# Altium schematic sheet Control sheet1.SchDoc
size A4; SheetNumber: 1; SheetTotal: 2
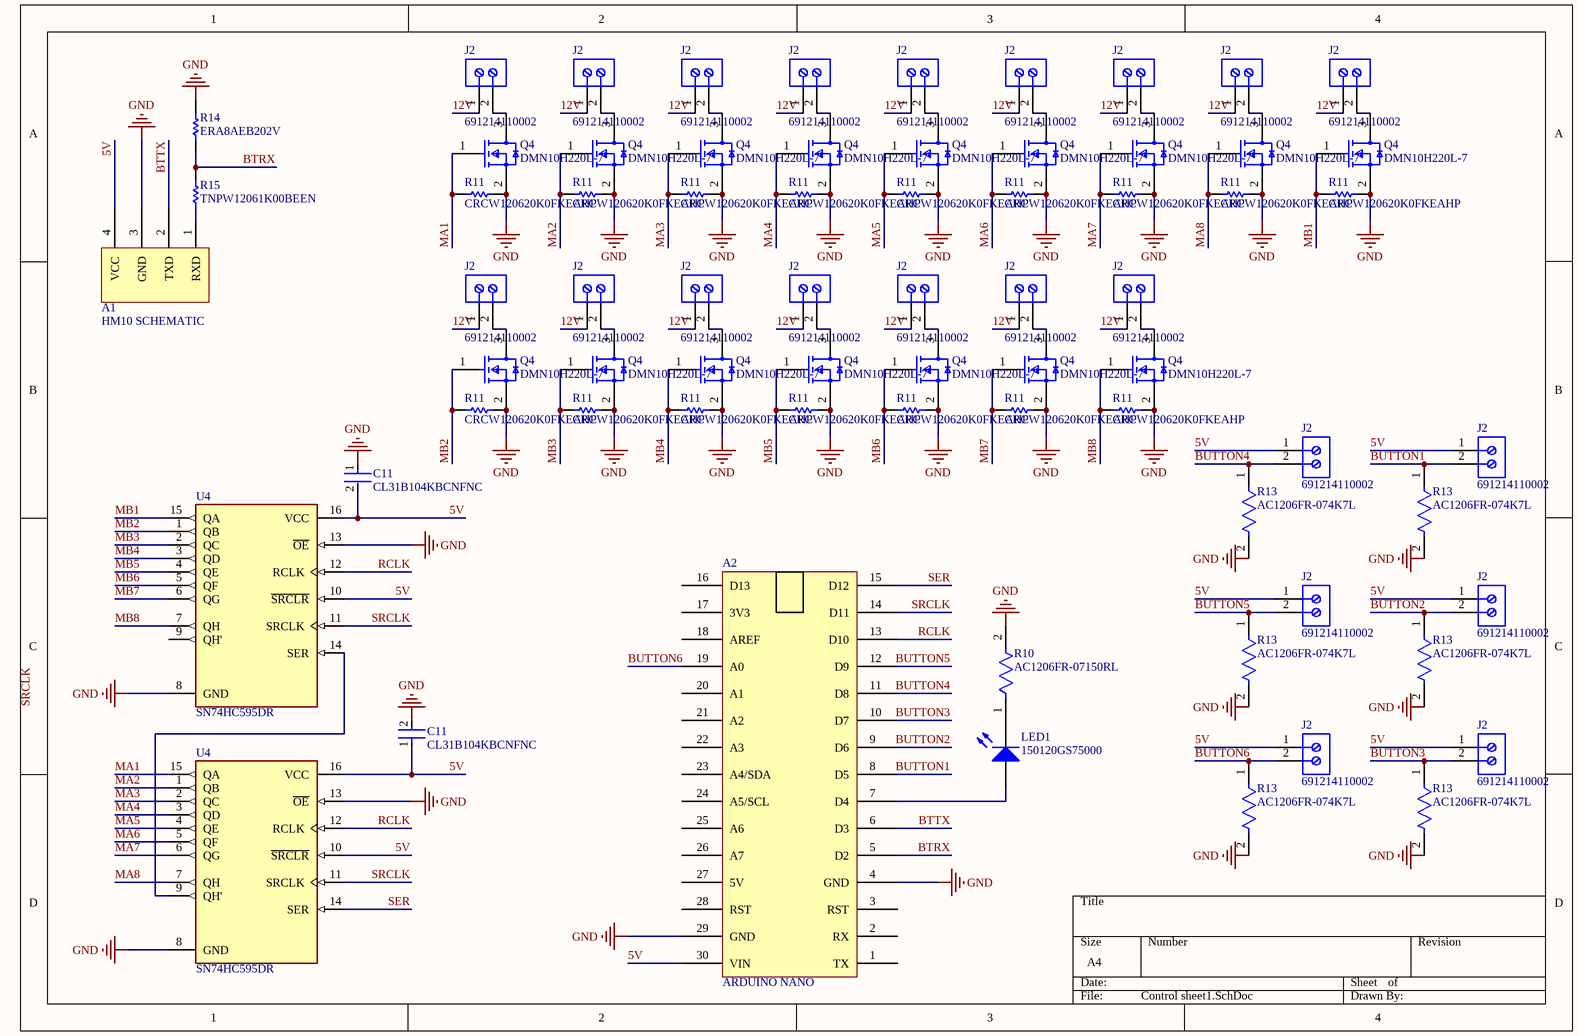
[diagram p0: Control sheet1.SchDoc]

## Parts
(Parts that share a designator on the sheet are numbered #1, #2 ... from top to bottom, then left to right.)
A1  HM10 SCHEMATIC  [HM10]
A2  ARDUINO NANO  [ARDUINO NANO]
C11#1  CL31B104KBCNFNC  [FP-CL31-IPC_C]
C11#2  CL31B104KBCNFNC  [FP-CL31-IPC_C]
J2#1  691214110002  [691214110002]
J2#2  691214110002  [691214110002]
J2#3  691214110002  [691214110002]
J2#4  691214110002  [691214110002]
J2#5  691214110002  [691214110002]
J2#6  691214110002  [691214110002]
J2#7  691214110002  [691214110002]
J2#8  691214110002  [691214110002]
J2#9  691214110002  [691214110002]
J2#10  691214110002  [691214110002]
J2#11  691214110002  [691214110002]
J2#12  691214110002  [691214110002]
J2#13  691214110002  [691214110002]
J2#14  691214110002  [691214110002]
J2#15  691214110002  [691214110002]
J2#16  691214110002  [691214110002]
J2#17  691214110002  [691214110002]
J2#18  691214110002  [691214110002]
J2#19  691214110002  [691214110002]
J2#20  691214110002  [691214110002]
J2#21  691214110002  [691214110002]
J2#22  691214110002  [691214110002]
LED1  150120GS75000  [1206_A]
Q4#1  DMN10H220L-7  [FP-SOT23-MFG]
Q4#2  DMN10H220L-7  [FP-SOT23-MFG]
Q4#3  DMN10H220L-7  [FP-SOT23-MFG]
Q4#4  DMN10H220L-7  [FP-SOT23-MFG]
Q4#5  DMN10H220L-7  [FP-SOT23-MFG]
Q4#6  DMN10H220L-7  [FP-SOT23-MFG]
Q4#7  DMN10H220L-7  [FP-SOT23-MFG]
Q4#8  DMN10H220L-7  [FP-SOT23-MFG]
Q4#9  DMN10H220L-7  [FP-SOT23-MFG]
Q4#10  DMN10H220L-7  [FP-SOT23-MFG]
Q4#11  DMN10H220L-7  [FP-SOT23-MFG]
Q4#12  DMN10H220L-7  [FP-SOT23-MFG]
Q4#13  DMN10H220L-7  [FP-SOT23-MFG]
Q4#14  DMN10H220L-7  [FP-SOT23-MFG]
Q4#15  DMN10H220L-7  [FP-SOT23-MFG]
Q4#16  DMN10H220L-7  [FP-SOT23-MFG]
R10  AC1206FR-07150RL  [FP-AC1206-MFG]
R11#1  CRCW120620K0FKEAHP  [RESC3116X65X50LL20T20]
R11#2  CRCW120620K0FKEAHP  [RESC3116X65X50LL20T20]
R11#3  CRCW120620K0FKEAHP  [RESC3116X65X50LL20T20]
R11#4  CRCW120620K0FKEAHP  [RESC3116X65X50LL20T20]
R11#5  CRCW120620K0FKEAHP  [RESC3116X65X50LL20T20]
R11#6  CRCW120620K0FKEAHP  [RESC3116X65X50LL20T20]
R11#7  CRCW120620K0FKEAHP  [RESC3116X65X50LL20T20]
R11#8  CRCW120620K0FKEAHP  [RESC3116X65X50LL20T20]
R11#9  CRCW120620K0FKEAHP  [RESC3116X65X50LL20T20]
R11#10  CRCW120620K0FKEAHP  [RESC3116X65X50LL20T20]
R11#11  CRCW120620K0FKEAHP  [RESC3116X65X50LL20T20]
R11#12  CRCW120620K0FKEAHP  [RESC3116X65X50LL20T20]
R11#13  CRCW120620K0FKEAHP  [RESC3116X65X50LL20T20]
R11#14  CRCW120620K0FKEAHP  [RESC3116X65X50LL20T20]
R11#15  CRCW120620K0FKEAHP  [RESC3116X65X50LL20T20]
R11#16  CRCW120620K0FKEAHP  [RESC3116X65X50LL20T20]
R13#1  AC1206FR-074K7L  [FP-AC1206-MFG]
R13#2  AC1206FR-074K7L  [FP-AC1206-MFG]
R13#3  AC1206FR-074K7L  [FP-AC1206-MFG]
R13#4  AC1206FR-074K7L  [FP-AC1206-MFG]
R13#5  AC1206FR-074K7L  [FP-AC1206-MFG]
R13#6  AC1206FR-074K7L  [FP-AC1206-MFG]
R14  ERA8AEB202V  [RESC3216X70X50ML20T25]
R15  TNPW12061K00BEEN  [RESC3216X65X50ML15T25]
U4#1  SN74HC595DR  [FP-D0016A-MFG]
U4#2  SN74HC595DR  [FP-D0016A-MFG]

## Nets
GND: A1.3(GND) A2.4(GND) A2.29(GND) C11#1.1 C11#2.2 Q4#1.2(S) Q4#2.2(S) Q4#3.2(S) Q4#4.2(S) Q4#5.2(S) Q4#6.2(S) Q4#7.2(S) Q4#8.2(S) Q4#9.2(S) Q4#10.2(S) Q4#11.2(S) Q4#12.2(S) Q4#13.2(S) Q4#14.2(S) Q4#15.2(S) Q4#16.2(S) R10.2 R11#1.2 R11#2.2 R11#3.2 R11#4.2 R11#5.2 R11#6.2 R11#7.2 R11#8.2 R11#9.2 R11#10.2 R11#11.2 R11#12.2 R11#13.2 R11#14.2 R11#15.2 R11#16.2 R13#1.2 R13#2.2 R13#3.2 R13#4.2 R13#5.2 R13#6.2 R14.2 U4#1.8(GND) U4#1.13(~{OE}) U4#2.8(GND) U4#2.13(~{OE})
5V: A1.4(VCC) A2.30(VIN) C11#1.2 C11#2.1 J2#17.1 J2#18.1 J2#19.1 J2#20.1 J2#21.1 J2#22.1 U4#1.10(~{SRCLR}) U4#1.16(VCC) U4#2.10(~{SRCLR}) U4#2.16(VCC)
12V: J2#1.1 J2#2.1 J2#3.1 J2#4.1 J2#5.1 J2#6.1 J2#7.1 J2#8.1 J2#9.1 J2#10.1 J2#11.1 J2#12.1 J2#13.1 J2#14.1 J2#15.1 J2#16.1
BTRX: A2.5(D2) R14.1 R15.2
BTTX: A1.2(TXD) A2.6(D3)
BUTTON1: A2.8(D5) J2#18.2 R13#2.1
BUTTON2: A2.9(D6) J2#20.2 R13#4.1
BUTTON3: A2.10(D7) J2#22.2 R13#6.1
BUTTON4: A2.11(D8) J2#17.2 R13#1.1
BUTTON5: A2.12(D9) J2#19.2 R13#3.1
BUTTON6: A2.19(A0) J2#21.2 R13#5.1
MA1: Q4#1.1(G) R11#1.1 U4#2.15(QA)
MA2: Q4#2.1(G) R11#2.1 U4#2.1(QB)
MA3: Q4#3.1(G) R11#3.1 U4#2.2(QC)
MA4: Q4#4.1(G) R11#4.1 U4#2.3(QD)
MA5: Q4#5.1(G) R11#5.1 U4#2.4(QE)
MA6: Q4#6.1(G) R11#6.1 U4#2.5(QF)
MA7: Q4#7.1(G) R11#7.1 U4#2.6(QG)
MA8: Q4#8.1(G) R11#8.1 U4#2.7(QH)
MB1: Q4#9.1(G) R11#9.1 U4#1.15(QA)
MB2: Q4#10.1(G) R11#10.1 U4#1.1(QB)
MB3: Q4#11.1(G) R11#11.1 U4#1.2(QC)
MB4: Q4#12.1(G) R11#12.1 U4#1.3(QD)
MB5: Q4#13.1(G) R11#13.1 U4#1.4(QE)
MB6: Q4#14.1(G) R11#14.1 U4#1.5(QF)
MB7: Q4#15.1(G) R11#15.1 U4#1.6(QG)
MB8: Q4#16.1(G) R11#16.1 U4#1.7(QH)
RCLK: A2.13(D10) U4#1.12(RCLK) U4#2.12(RCLK)
SER: A2.15(D12) U4#2.14(SER)
SRCLK: A2.14(D11) U4#1.11(SRCLK) U4#2.11(SRCLK)
NetA1_1: A1.1(RXD) R15.1
NetA2_7: A2.7(D4) LED1.2(A)
NetJ2#1_2: J2#1.2 Q4#1.3(D)
NetJ2#2_2: J2#2.2 Q4#2.3(D)
NetJ2#3_2: J2#3.2 Q4#3.3(D)
NetJ2#4_2: J2#4.2 Q4#4.3(D)
NetJ2#5_2: J2#5.2 Q4#5.3(D)
NetJ2#6_2: J2#6.2 Q4#6.3(D)
NetJ2#7_2: J2#7.2 Q4#7.3(D)
NetJ2#8_2: J2#8.2 Q4#8.3(D)
NetJ2#9_2: J2#9.2 Q4#9.3(D)
NetJ2#10_2: J2#10.2 Q4#10.3(D)
NetJ2#11_2: J2#11.2 Q4#11.3(D)
NetJ2#12_2: J2#12.2 Q4#12.3(D)
NetJ2#13_2: J2#13.2 Q4#13.3(D)
NetJ2#14_2: J2#14.2 Q4#14.3(D)
NetJ2#15_2: J2#15.2 Q4#15.3(D)
NetJ2#16_2: J2#16.2 Q4#16.3(D)
NetLED1_1: LED1.1(K) R10.1
NetU4#1_14: U4#1.14(SER) U4#2.9(QH')

Not connected (* = marked no-connect by the designer): A2 1(TX) 2(RX) 3(RST) 16(D13) 17(3V3) 18(AREF) 20(A1) 21(A2) 22(A3) 23(A4/SDA) 24(A5/SCL) 25(A6) 26(A7) 27(5V) 28(RST); U4#1 9(QH')

## Notes on the sheet
- Labels drawn without touching a wire or pin: SRCLK

## Library data of the parts
C11#1 C11#2 = CMP-13271-001276-1: Cap Ceramic 100nF 50V X7R ±10% SMD 1206 +125°C Embossed T/R; Dielectric: X7R; Case Code (Metric): 3216; Package Quantity: 1; Thickness: 0.037inch; Depth: 1.6mm; Packaging: Tape and Reel; Capacitance: 100nF; Length: 0.126inch; Tolerance: 10%; Voltage Rating: 50V; Case Code (Imperial): 1206; Radiation Hardening: No; Width: 0.063inch; Case/Package: 1206; Max Operating Temperature: 125°C; Min Operating Temperature: -55°C; Height: 0.85mm; Mount: Surface Mount
J2#1-J2#22 = CMP-1502-02464-1: Serie 2141 - 3.50 mm Horizontal Entry Modular with Rising Cage Clamp WR-TBL, 2 pin; Manufacturer: Wurth Elektronik; Pin Number: 2; Pitch: 3.50mm; Datasheet URL: http://katalog.we-online.de/em/datasheet/6912141100xx.pdf; Packaging: Box; Mounting Technology: THT; Package Reference: 691214110002; Manufacturer URL: http://www.we-online.de; Part Number: 691214110002; Publisher: WurthElektronik; Operating Temperature: -40to105degC
LED1 = CMP-1426-00014-1: SMD mono-color Chip LED, WL-SMCW, Green; Manufacturer: Wuerth Elektronik; PackageReference: 1206_A; PartNumber: 150120GS75000; ComponentLink1Description: Manufacturer URL; ComponentLink2URL: http://katalog.we-online.com/led/datasheet/150120GS75000.pdf; ComponentLink2Description: Datasheet; Color: Green; ComponentLink1URL: http://www.we-online.com
Q4#1-Q4#16 = CMP-12801-000027-1: MOSFET N-CH 100V 1.6A SOT-23; Manufacturer: Diodes Inc.; Typ Forward Diode Voltage: 0.7V; Max Junction Temp: +150°C; Reverse Recovery Charge: 9.8nC; Gate Charge At Vgs: 8.3nC @ 10V; Turn Off Delay Time: 7.9ns; Depletion Mode: False; Power Dissipation: 1.3W; Rthja Max: 177°C/W; Reverse Recovery Time: 17ns; Gate To Source Voltage: 16V; Drain To Source Resistance: 250mΩ; Threshold Vgs Max: 2.5V; Turn On Delay Time: 6.8ns; Threshold Vgs Min: 1V; Pulse Drain Current: 8A; Number Of Channels: 1; Max Forward Diode Voltage: 1.2V; Standoff Height: 0.013mm; Input Capacitace At Vds: 401pF @ 25V; Continuous Drain Current: 1.4A; Manufacturer Part Number: DMN10H220L-7; Device Class L2: Transistors; Automotive: No; Device Class L3: MOSFETs; Drain To Source Breakdown Voltage: 100V; Footprint Url: https://www.diodes.com/assets/Package-Files/SOT23.pdf; Package: SOT23; Lead Free: Yes; Temperature: -55°C to +150°C; Drain To Source Voltage: 100V; Device Class L1: Discrete Semiconductors; ComponentLink2URL: https://www.diodes.com/assets/Datasheets/DMN10H220L.pdf; Temperature Range High: +150°C; Temperature Range Low: -55°C; Category: Trans; Mouser Description: DMN10H220L Series 100 V 250 mOhm N-Channel Enhancement Mode Mosfet - SOT-23; RoHS: TRUE; ComponentLink2Description: Datasheet; Height: 1.1mm; Digikey Description: MOSFET N-CH 100V 1.6A SOT-23; Octopart: https://octopart.com/dmn10h220l-7-diodes+inc.-38898610; Number Of N Channels: 1
R10 = CMP-2003-04913-2: RES SMD 150 OHM 1% 1/4W 1206; Manufacturer: Yageo; Voltage Rating: 200V; Power Rating: 0.25W; Resistance: 150Ω; Automotive Grade: Grade 0; Tolerance: 0.01; Value: 150Ω; Category: Res; Series: AC; Composition: Thick Film; Mouser Description: Thick Film Resistors 150ohm 1% 1/4W AEC-Q200; Temperature: -55°C to +155°C; Temperature Range High: +155°C; Device Class L1: Passive Components; Device Class L2: Resistors; Digikey Description: RES SMD 150 OHM 1% 1/4W 1206; Manufacturer Part Number: AC1206FR-07150RL; Ipc Land Pattern Name: RESC310160X55; Package: AC1206; Device Class L3: Chip SMD Resistors; Octopart: https://octopart.com/ac1206fr-07150rl-yageo-21711118; ComponentLink2URL: http://www.yageo.com/NewPortal/yageodocoutput?fileName=/pdf/R-Chip/PYu-AC_51_RoHS_L_6.pdf; Height: 0.65mm; Lead Free: Yes; RoHS: TRUE; Footprint Url: http://www.yageo.com/exep/pages/download/literatures/PYu-R_Mount_10.pdf; Temperature Range Low: -55°C; Automotive: Yes; ComponentLink2Description: Datasheet
R11#1-R11#16 = CMP-2003-04875-1: Manufacturer: Vishay Dale; Part Number: CRCW120620K0FKEAHP
R13#1-R13#6 = CMP-2003-04896-2: RES SMD 4.7K OHM 1% 1/4W 1206; Manufacturer: Yageo; Value: 4.7KΩ; Tolerance: 0.01; Automotive Grade: Grade 0; Power Rating: 0.25W; Voltage Rating: 200V; Mouser Description: Thick Film Resistors - SMD 1/4W 4.7K ohm 1% AEC-Q200; Footprint Url: http://www.yageo.com/exep/pages/download/literatures/PYu-R_Mount_10.pdf; Resistance: 4.7KΩ; Height: 0.65mm; Temperature: -55°C to +155°C; Category: Res; ComponentLink2Description: Datasheet; Series: AC; Device Class L2: Resistors; Device Class L1: Passive Components; RoHS: TRUE; Digikey Description: RES SMD 4.7K OHM 1% 1/4W 1206; Manufacturer Part Number: AC1206FR-074K7L; Device Class L3: Chip SMD Resistors; Octopart: https://octopart.com/ac1206fr-074k7l-yageo-25629454; Temperature Range Low: -55°C; Ipc Land Pattern Name: RESC310160X55; Temperature Range High: +155°C; Composition: Thick Film; ComponentLink2URL: http://www.yageo.com/NewPortal/yageodocoutput?fileName=/pdf/R-Chip/PYu-AC_51_RoHS_L_6.pdf; Automotive: Yes; Lead Free: Yes; Package: AC1206
R14 = CMP-2003-04435-1: Manufacturer: Panasonic; Part Number: ERA8AEB202V
R15 = CMP-2003-04643-1: Manufacturer: Vishay Dale; Part Number: TNPW12061K00BEEN
U4#1 U4#2 = CMP-0780-00037-4: IC 8BIT SHIFT REG 3ST-OUT 16SOIC; Manufacturer: Texas Instruments; Max Supply Voltage: 6V; Nominal Supply Current: 80uA; Number Of Circuits: 1; Max Junction Temp: +150°C; Propagation Delay: 43ns; Frequency: 29MHz; Min Supply Voltage: 2V; Standoff Height: 0.1mm; Number Of Outputs: 9; Height: 1.75mm; Automotive: No; Device Class L1: Integrated Circuits (ICs); ComponentLink2Description: Datasheet; Ambient Temperature Range Low: -40°C; Ambient Temperature Range High: +85°C; Digikey Description: IC 8BIT SHIFT REG 3ST-OUT 16SOIC; ComponentLink2URL: http://www.ti.com/lit/ds/symlink/sn74hc595.pdf; Package: D0016A; Lead Free: Yes; Manufacturer Part Number: SN74HC595DR; Device Class L3: Shift Registers; Category: IC; Number Of Inputs: 1; Octopart: https://octopart.com/sn74hc595dr-texas+instruments-500634; Ipc Land Pattern Name: SOIC127P600X175-16; Device Class L2: Logic ICs; Temperature Range Low: -40°C; RoHS: TRUE; Temperature: -40°C to +85°C; Temperature Range High: +85°C; Mouser Description: Counter Shift Registers 8bit Shift